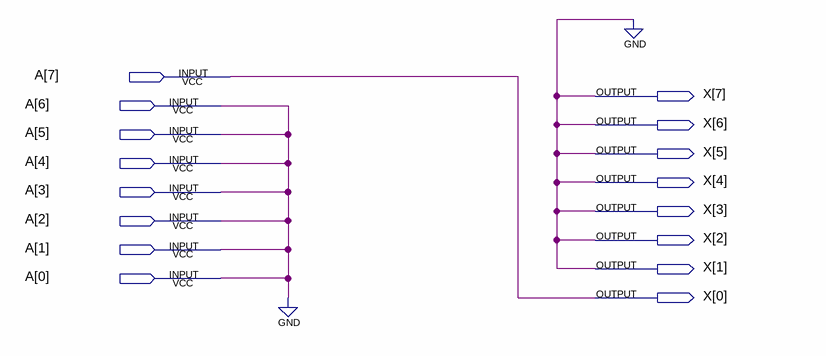
[diagram p0: schematic sheet]
// Quartus schematic CORR7.bdf as structural Verilog: 0 symbols, 16 pins
module CORR7 (
  input  [7:0] A,
  output [7:0] X
);


  assign A[5:0] = {6{A[6]}};
  assign X = {{7{1'b0}}, A[7]};
  // also tied to GND on the sheet: A[6]
endmodule
